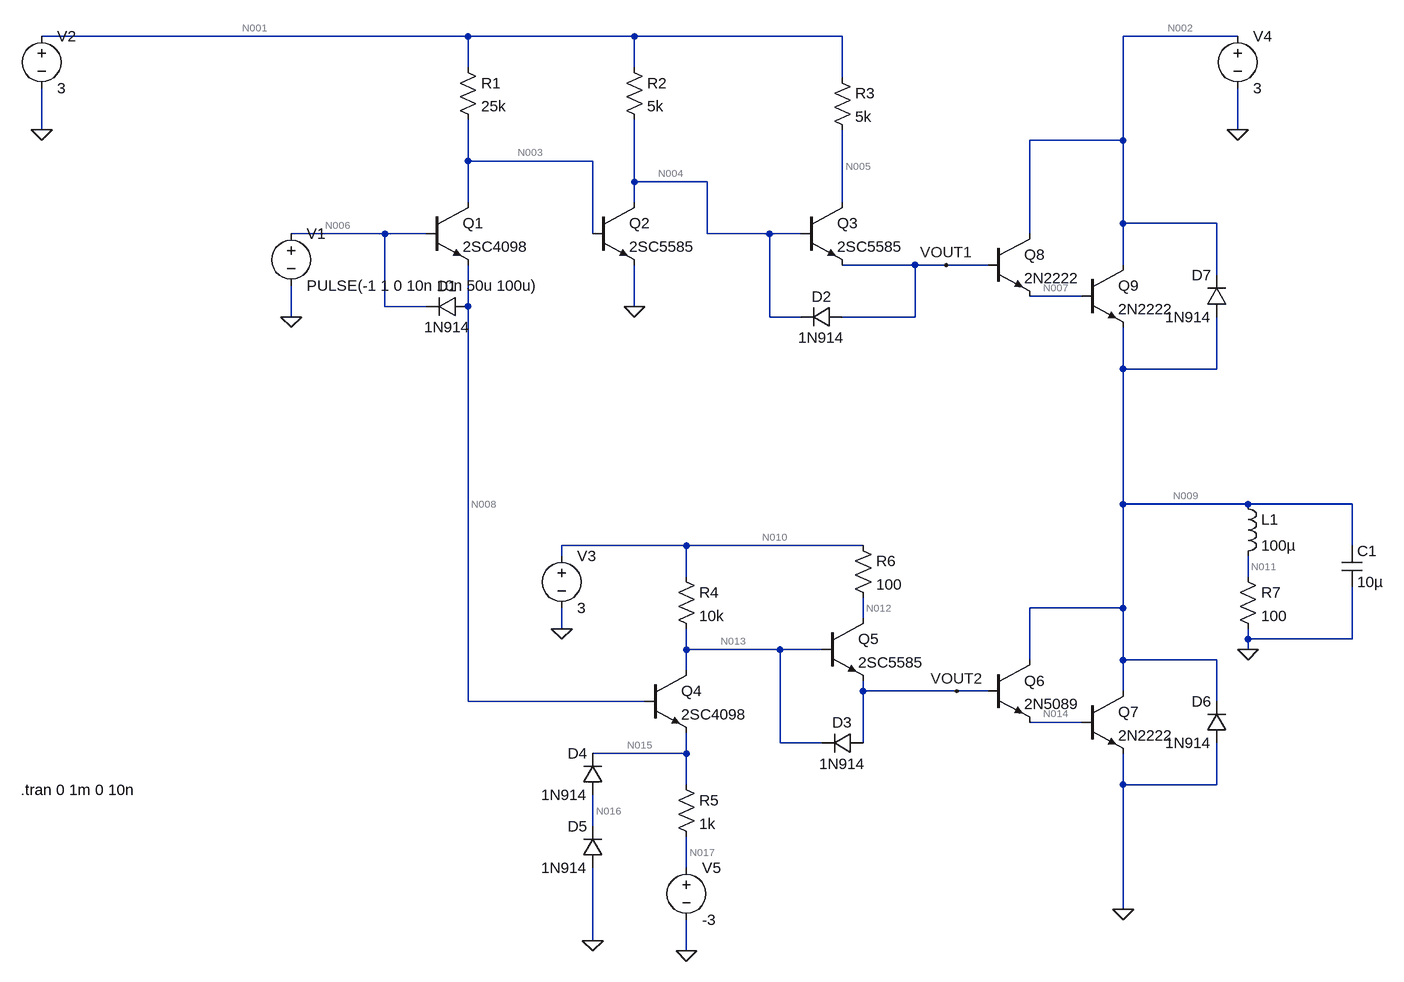
[diagram p0: schematic PDM.asc]
PDM.asc, the LTspice schematic file:
Version 4
SHEET 1 1464 1284
WIRE 48 -144 -608 -144
WIRE 304 -144 48 -144
WIRE 624 -144 304 -144
WIRE 1232 -144 1056 -144
WIRE 48 -96 48 -144
WIRE 304 -96 304 -144
WIRE 624 -80 624 -144
WIRE -608 0 -608 -64
WIRE 1232 0 1232 -64
WIRE 1056 16 1056 -144
WIRE 1056 16 912 16
WIRE 48 48 48 -16
WIRE 240 48 48 48
WIRE 304 80 304 -16
WIRE 416 80 304 80
WIRE 48 112 48 48
WIRE 304 112 304 80
WIRE 624 112 624 0
WIRE 1056 144 1056 16
WIRE 1200 144 1056 144
WIRE -80 160 -224 160
WIRE -16 160 -80 160
WIRE 240 160 240 48
WIRE 416 160 416 80
WIRE 512 160 416 160
WIRE 560 160 512 160
WIRE 912 160 912 16
WIRE 736 208 624 208
WIRE 784 208 736 208
WIRE 848 208 784 208
WIRE 1056 208 1056 144
WIRE 1200 224 1200 144
WIRE 992 256 912 256
WIRE -80 272 -80 160
WIRE -16 272 -80 272
WIRE 48 272 48 208
WIRE 304 272 304 208
WIRE -224 288 -224 240
WIRE 512 288 512 160
WIRE 560 288 512 288
WIRE 736 288 736 208
WIRE 736 288 624 288
WIRE 1056 368 1056 304
WIRE 1200 368 1200 288
WIRE 1200 368 1056 368
WIRE 1056 576 1056 368
WIRE 1248 576 1056 576
WIRE 1408 576 1248 576
WIRE 384 640 192 640
WIRE 656 640 384 640
WIRE 1408 640 1408 576
WIRE 192 656 192 640
WIRE 384 688 384 640
WIRE 1248 688 1248 656
WIRE 1056 736 1056 576
WIRE 1056 736 912 736
WIRE 656 752 656 720
WIRE 192 768 192 736
WIRE 1248 784 1248 768
WIRE 1408 784 1408 704
WIRE 1408 784 1248 784
WIRE 384 800 384 768
WIRE 528 800 384 800
WIRE 592 800 528 800
WIRE 1248 800 1248 784
WIRE 912 816 912 736
WIRE 1056 816 1056 736
WIRE 1200 816 1056 816
WIRE 384 832 384 800
WIRE 656 864 656 848
WIRE 800 864 656 864
WIRE 848 864 800 864
WIRE 1056 864 1056 816
WIRE 48 880 48 272
WIRE 320 880 48 880
WIRE 1200 880 1200 816
WIRE 992 912 912 912
WIRE 528 944 528 800
WIRE 592 944 528 944
WIRE 656 944 656 864
WIRE 384 960 384 928
WIRE 384 960 240 960
WIRE 384 1008 384 960
WIRE 1056 1008 1056 960
WIRE 1200 1008 1200 944
WIRE 1200 1008 1056 1008
WIRE 240 1072 240 1024
WIRE 384 1136 384 1088
WIRE 1056 1200 1056 1008
WIRE 240 1248 240 1136
WIRE 384 1264 384 1216
FLAG -224 288 0
FLAG 784 208 VOUT1
FLAG 304 272 0
FLAG -608 0 0
FLAG 800 864 VOUT2
FLAG 192 768 0
FLAG 1248 800 0
FLAG 1232 0 0
FLAG 384 1264 0
FLAG 240 1248 0
FLAG 1056 1200 0
DATAFLAG -80 -144 ""
SYMBOL npn -16 112 R0
SYMATTR InstName Q1
SYMATTR Value 2SC4098
SYMBOL diode 48 256 R90
WINDOW 0 0 32 VBottom 2
WINDOW 3 32 32 VTop 2
SYMATTR InstName D1
SYMATTR Value 1N914
SYMBOL diode 624 272 R90
WINDOW 0 0 32 VBottom 2
WINDOW 3 32 32 VTop 2
SYMATTR InstName D2
SYMATTR Value 1N914
SYMBOL voltage -224 144 R0
WINDOW 123 0 0 Left 0
WINDOW 39 0 0 Left 0
SYMATTR InstName V1
SYMATTR Value PULSE(-1 1 0 10n 10n 50u 100u)
SYMBOL npn 240 112 R0
SYMATTR InstName Q2
SYMATTR Value 2SC5585
SYMBOL npn 560 112 R0
SYMATTR InstName Q3
SYMATTR Value 2SC5585
SYMBOL res 32 -112 R0
SYMATTR InstName R1
SYMATTR Value 25k
SYMBOL res 288 -112 R0
SYMATTR InstName R2
SYMATTR Value 5k
SYMBOL res 608 -96 R0
SYMATTR InstName R3
SYMATTR Value 5k
SYMBOL res 368 672 R0
SYMATTR InstName R4
SYMATTR Value 10k
SYMBOL res 368 992 R0
SYMATTR InstName R5
SYMATTR Value 1k
SYMBOL npn 592 752 R0
SYMATTR InstName Q5
SYMATTR Value 2SC5585
SYMBOL res 640 624 R0
SYMATTR InstName R6
SYMATTR Value 100
SYMBOL diode 656 928 R90
WINDOW 0 0 32 VBottom 2
WINDOW 3 32 32 VTop 2
SYMATTR InstName D3
SYMATTR Value 1N914
SYMBOL voltage -608 -160 R0
WINDOW 123 0 0 Left 0
WINDOW 39 0 0 Left 0
SYMATTR InstName V2
SYMATTR Value 3
SYMBOL voltage 192 640 R0
WINDOW 123 0 0 Left 0
WINDOW 39 0 0 Left 0
SYMATTR InstName V3
SYMATTR Value 3
SYMBOL npn 848 816 R0
SYMATTR InstName Q6
SYMATTR Value 2N5089
SYMBOL res 1232 672 R0
SYMATTR InstName R7
SYMATTR Value 100
SYMBOL npn 992 864 R0
SYMATTR InstName Q7
SYMATTR Value 2N2222
SYMBOL npn 848 160 R0
SYMATTR InstName Q8
SYMATTR Value 2N2222
SYMBOL npn 992 208 R0
SYMATTR InstName Q9
SYMATTR Value 2N2222
SYMBOL voltage 1232 -160 R0
WINDOW 123 0 0 Left 0
WINDOW 39 0 0 Left 0
SYMATTR InstName V4
SYMATTR Value 3
SYMBOL voltage 384 1120 R0
WINDOW 123 0 0 Left 0
WINDOW 39 0 0 Left 0
SYMATTR InstName V5
SYMATTR Value -3
SYMBOL diode 256 1024 R180
WINDOW 0 24 64 Left 2
WINDOW 3 24 0 Left 2
SYMATTR InstName D4
SYMATTR Value 1N914
SYMBOL diode 256 1136 R180
WINDOW 0 24 64 Left 2
WINDOW 3 24 0 Left 2
SYMATTR InstName D5
SYMATTR Value 1N914
SYMBOL npn 320 832 R0
SYMATTR InstName Q4
SYMATTR Value 2SC4098
SYMBOL diode 1216 944 R180
WINDOW 0 24 64 Left 2
WINDOW 3 24 0 Left 2
SYMATTR InstName D6
SYMATTR Value 1N914
SYMBOL diode 1216 288 R180
WINDOW 0 24 64 Left 2
WINDOW 3 24 0 Left 2
SYMATTR InstName D7
SYMATTR Value 1N914
SYMBOL ind 1232 560 R0
SYMATTR InstName L1
SYMATTR Value 100µ
SYMBOL cap 1392 640 R0
SYMATTR InstName C1
SYMATTR Value 10µ
TEXT -640 1016 Left 2 !.tran 0 1m 0 10n

The netlist it stands for:
* PDM.asc
Q1 N003 N006 N008 0 2SC4098
D1 N008 N006 1N914
D2 VOUT1 N004 1N914
V1 N006 0 PULSE(-1 1 0 10n 10n 50u 100u)
Q2 N004 N003 0 0 2SC5585
Q3 N005 N004 VOUT1 0 2SC5585
R1 N001 N003 25k
R2 N001 N004 5k
R3 N001 N005 5k
R4 N010 N013 10k
R5 N015 N017 1k
Q5 N012 N013 VOUT2 0 2SC5585
R6 N010 N012 100
D3 VOUT2 N013 1N914
V2 N001 0 3
V3 N010 0 3
Q6 N009 VOUT2 N014 0 2N5089
R7 N011 0 100
Q7 N009 N014 0 0 2N2222
Q8 N002 VOUT1 N007 0 2N2222
Q9 N002 N007 N009 0 2N2222
V4 N002 0 3
V5 N017 0 -3
D4 N016 N015 1N914
D5 0 N016 1N914
Q4 N013 N008 N015 0 2SC4098
D6 0 N009 1N914
D7 N009 N002 1N914
L1 N009 N011 100µ
C1 N009 0 10µ
.model D D
.lib standard.dio
.model NPN NPN
.model PNP PNP
.lib standard.bjt
.tran 0 1m 0 10n
.backanno
.end

* Results of the author's LTspice run, read from the files saved beside the schematic
* Operating Point, zero values left out:
*   V(n003) = 642.3 mV
*   V(n006) = -1 V
*   V(n008) = -1.002 V
*   V(vout1) = 2.741 mV
*   V(n004) = 2.668 mV
*   V(n005) = 3 V
*   V(n001) = 3 V
*   V(n010) = 3 V
*   V(n013) = 2.25 V
*   V(n015) = -1.222 V
*   V(n017) = -3 V
*   V(n012) = 1.639 V
*   V(vout2) = 1.586 V
*   V(n009) = 685.1 mV
*   V(n014) = 707 mV
*   V(n011) = 685.1 mV
*   V(n002) = 3 V
*   V(n007) = 937.9 mV
*   V(n016) = -611.2 mV
*   Ic(Q9) = 181.3 pA
*   Ie(Q9) = -180.4 pA
*   Ic(Q8) = 3.001 pA
*   Ib(Q8) = -3.936 pA
*   Ic(Q7) = 6.799 mA
*   Ib(Q7) = 34.77 µA
*   Ie(Q7) = -6.834 mA
*   Ic(Q6) = -13.65 mA
*   Ib(Q6) = 13.68 mA
*   Ie(Q6) = -34.77 µA
*   Ic(Q5) = 13.61 mA
*   Ib(Q5) = 74.97 µA
*   Ie(Q5) = -13.68 mA
*   Ic(Q3) = 4.119 pA
*   Ib(Q3) = -3.975 pA
*   Ic(Q2) = 599.5 µA
*   Ib(Q2) = 94.31 µA
*   Ie(Q2) = -693.8 µA
*   Ic(Q4) = 255.4 pA
*   Ib(Q4) = 91.94 pA
*   Ie(Q4) = -347.4 pA
*   Ic(Q1) = 43.64 pA
*   Ib(Q1) = -43.58 pA
*   I(D7) = -2.522 nA
*   I(D6) = -2.521 nA
*   I(D5) = 1.778 mA
*   I(D4) = 1.778 mA
*   I(D3) = -2.521 nA
*   I(D2) = 4.077 pA
*   I(D1) = -91.87 pA
*   I(L1) = 6.851 mA
*   I(R7) = 6.851 mA
*   I(R6) = 13.61 mA
*   I(R5) = 1.778 mA
*   I(R4) = 74.97 µA
*   I(R3) = 4.121 pA
*   I(R2) = 599.5 µA
*   I(R1) = 94.31 µA
*   I(V5) = 1.778 mA
*   I(V4) = -2.707 nA
*   I(V3) = -13.68 mA
*   I(V2) = -693.8 µA
*   I(V1) = -48.3 pA
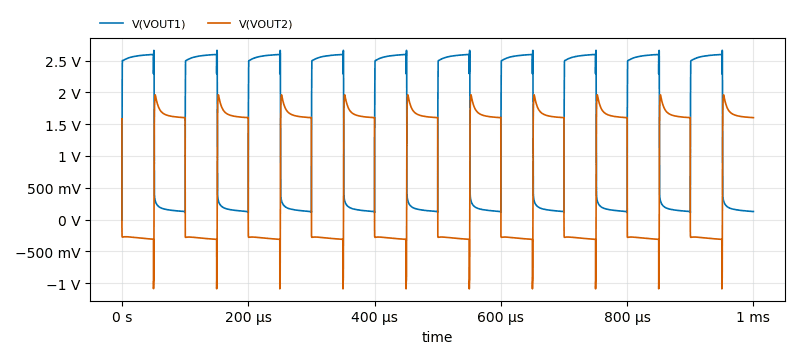
[diagram p1: Transient Analysis of PDM.asc, plotted from the saved traces]
* Transient Analysis, 1 run:
*   V(VOUT1): min -15.27 mV, max 2.66 V, average 1.387 V, rms 1.832 V, last 125.7 mV
*   V(VOUT2): min -1.09 V, max 1.962 V, average 664.7 mV, rms 1.188 V, last 1.602 V